# Altium project FP.PrjPcb
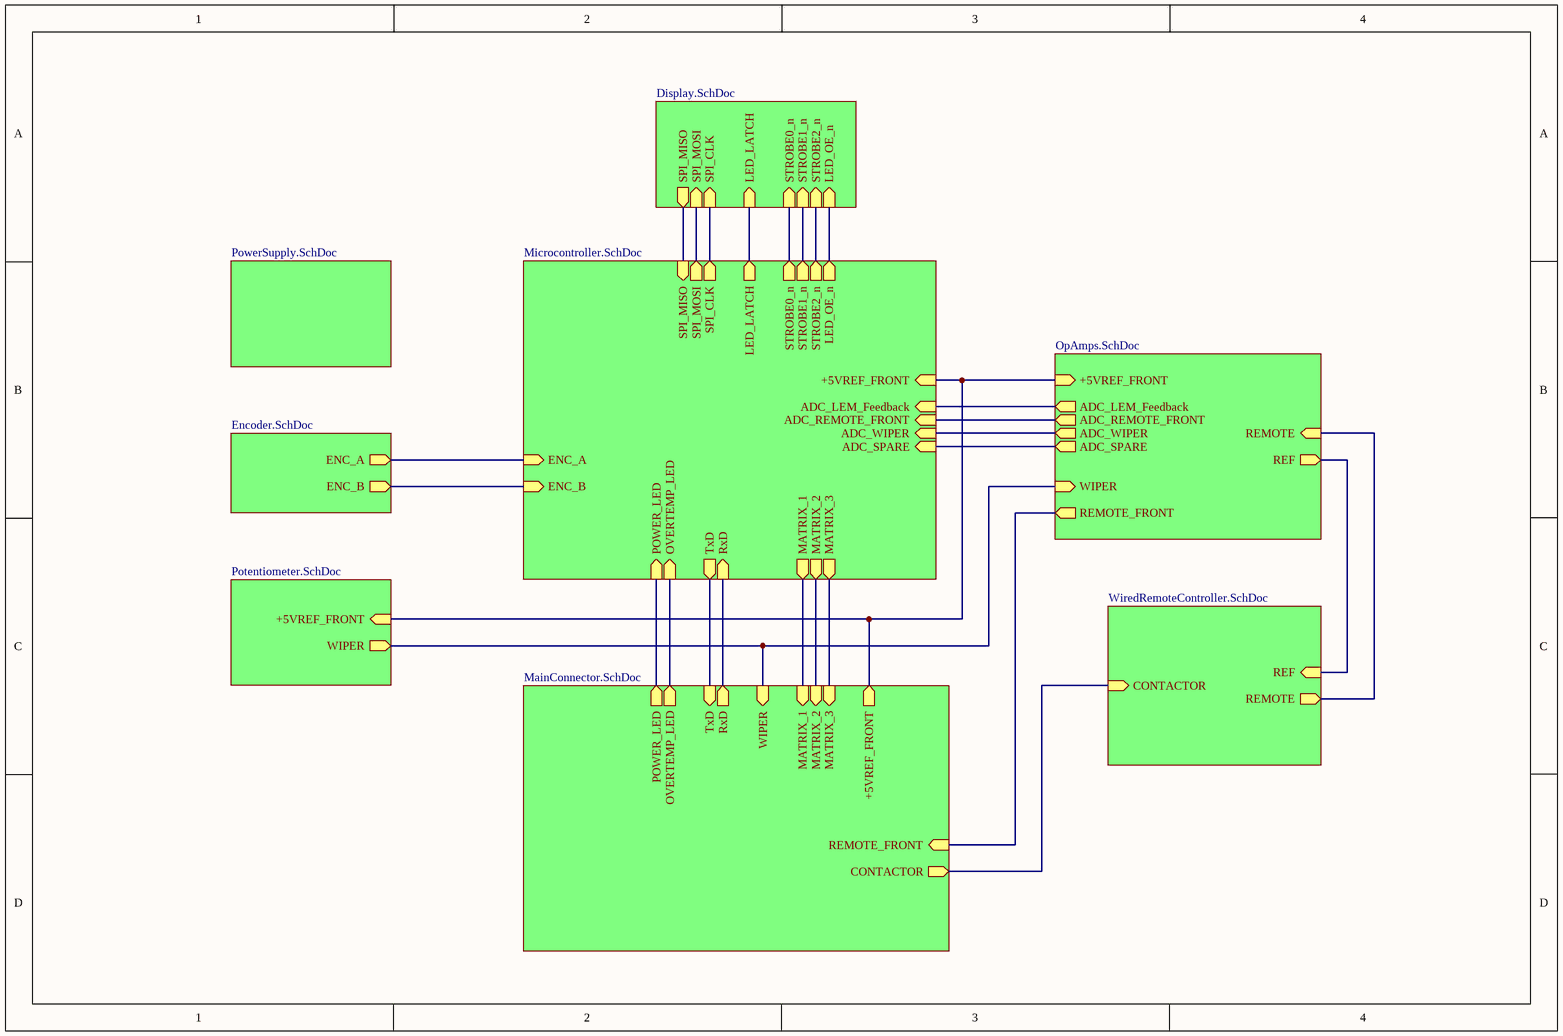
[diagram p0: Main.SchDoc]
9 sheets, 193 parts. Net scope: hierarchical (ports join the sheet entries above them; power ports are global).
Board file: PCB1.PcbDoc
Sheets:
  Main.SchDoc
    PS = PowerSupply.SchDoc
    MC = Microcontroller.SchDoc
    OA = OpAmps.SchDoc
    RC = WiredRemoteController.SchDoc
    D = Display.SchDoc
    E = Encoder.SchDoc
    P = Potentiometer.SchDoc
    C = MainConnector.SchDoc

## Sheet Main.SchDoc
size A4

### Sub-sheets
C = MainConnector.SchDoc: CONTACTOR (out), POWER_LED (out), RxD (out), +5VREF_FRONT (out), OVERTEMP_LED (out), REMOTE_FRONT (in), WIPER (in), MATRIX_3 (in), MATRIX_2 (in), MATRIX_1 (in), TxD (in)
D = Display.SchDoc: SPI_MOSI (in), LED_LATCH (in), STROBE0_n (in), SPI_MISO (out), SPI_CLK (in), STROBE1_n (in), LED_OE_n (in), STROBE2_n (in)
E = Encoder.SchDoc: ENC_B (out), ENC_A (out)
MC = Microcontroller.SchDoc: ADC_REMOTE_FRONT (in), MATRIX_1 (out), MATRIX_3 (out), ADC_LEM_Feedback (in), MATRIX_2 (out), ADC_SPARE (in), ADC_WIPER (in), +5VREF_FRONT (in), ENC_B (in), LED_OE_n (out), LED_LATCH (out), ENC_A (in), STROBE0_n (out), SPI_CLK (out), SPI_MOSI (out), STROBE2_n (out), STROBE1_n (out), SPI_MISO (in), POWER_LED (in), OVERTEMP_LED (in), RxD (in), TxD (out)
OA = OpAmps.SchDoc: REMOTE (in), ADC_WIPER (out), REMOTE_FRONT (out), ADC_REMOTE_FRONT (out), WIPER (in), ADC_SPARE (out), ADC_LEM_Feedback (out), +5VREF_FRONT (in), REF (out)
P = Potentiometer.SchDoc: WIPER (out), +5VREF_FRONT (in)
PS = PowerSupply.SchDoc: no entries
RC = WiredRemoteController.SchDoc: REF (in), REMOTE (out), CONTACTOR (in)

### Nets
+5VREF_FRONT: sheet MC/+5VREF_FRONT, sheet OA/+5VREF_FRONT, sheet P/+5VREF_FRONT, sheet C/+5VREF_FRONT
ADC_LEM_Feedback: sheet MC/ADC_LEM_Feedback, sheet OA/ADC_LEM_Feedback
ADC_REMOTE_FRONT: sheet MC/ADC_REMOTE_FRONT, sheet OA/ADC_REMOTE_FRONT
ADC_SPARE: sheet MC/ADC_SPARE, sheet OA/ADC_SPARE
ADC_WIPER: sheet MC/ADC_WIPER, sheet OA/ADC_WIPER
ENC_A: sheet MC/ENC_A, sheet E/ENC_A
ENC_B: sheet MC/ENC_B, sheet E/ENC_B
LED_LATCH: sheet MC/LED_LATCH, sheet D/LED_LATCH
LED_OE_n: sheet MC/LED_OE_n, sheet D/LED_OE_n
REMOTE_FRONT: sheet OA/REMOTE_FRONT, sheet C/REMOTE_FRONT
STROBE0_n: sheet MC/STROBE0_n, sheet D/STROBE0_n
STROBE1_n: sheet MC/STROBE1_n, sheet D/STROBE1_n
STROBE2_n: sheet MC/STROBE2_n, sheet D/STROBE2_n
NetC1_2: sheet OA/REMOTE, sheet RC/REMOTE
NetC2_2: sheet OA/REF, sheet RC/REF
NetC3_1: sheet MC/OVERTEMP_LED, sheet C/OVERTEMP_LED
NetC4_1: sheet MC/POWER_LED, sheet C/POWER_LED
NetC7_2: sheet RC/CONTACTOR, sheet C/CONTACTOR
NetC22_2: sheet OA/WIPER, sheet P/WIPER, sheet C/WIPER
NetR12_1: sheet MC/SPI_CLK, sheet D/SPI_CLK
NetR15_1: sheet MC/SPI_MOSI, sheet D/SPI_MOSI
NetR18_1: sheet MC/SPI_MISO, sheet D/SPI_MISO
NetR26_2: sheet MC/MATRIX_2, sheet C/MATRIX_2
NetR33_2: sheet MC/MATRIX_3, sheet C/MATRIX_3
NetR38_2: sheet MC/MATRIX_1, sheet C/MATRIX_1
NetR62_2: sheet MC/TxD, sheet C/TxD
NetR63_2: sheet MC/RxD, sheet C/RxD

## Sheet PowerSupply.SchDoc
size A4
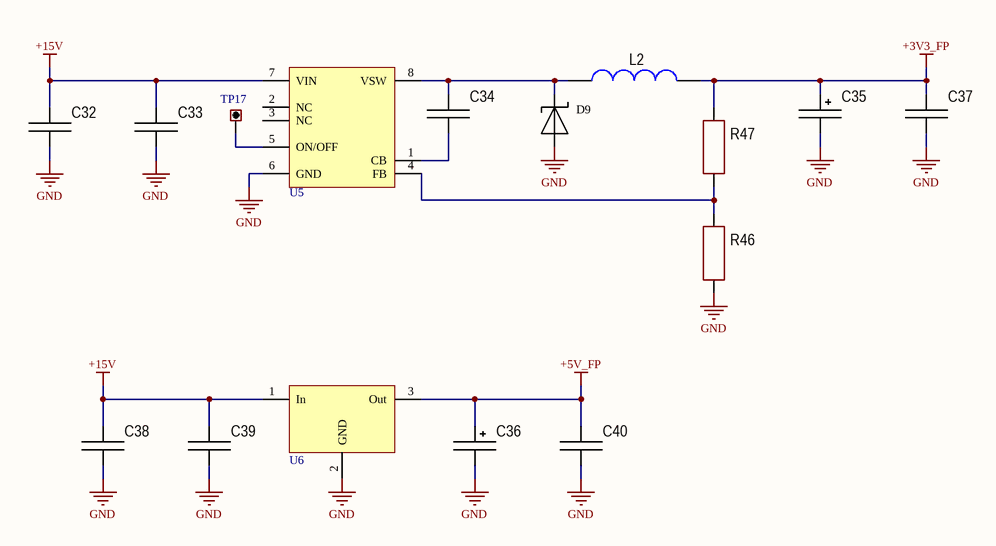
[diagram p1: PowerSupply.SchDoc]

### Parts
C32  (no value)  [CAP: 1210]
C33  (no value)  [CAP: 1206]
C34  (no value)  [CAP: 1206]
C35  (no value)  [CAPAE7866X58L]
C36  (no value)  [CAPAE7866X58L]
C37  (no value)  [CAP: 1206]
C38  (no value)  [CAP: 1210]
C39  (no value)  [CAP: 1206]
C40  (no value)  [CAP: 1206]
D9  (no value)  [DIODE: SMB]
L2  (no value)  [7447720181@WURTH]
R46  (no value)  [RES: 1206]
R47  (no value)  [RES: 1206]
TP17  Test_Point  [Test_Point]  (value not drawn)  (no BOM)
U5  (no value)  [8-SOIC]
U6  (no value)  [DPAK]

### Nets
+3V3_FP: C35.1 C37.2 L2.1 R47.2
+5V_FP: C36.1 C40.2 U6.3(Out)
+15V: C32.2 C33.2 C38.2 C39.2 U5.7(VIN) U6.1(In)
GND: C32.1 C33.1 C35.2 C36.2 C37.1 C38.1 C39.1 C40.1 D9.1 R46.1 U5.6(GND) U6.2(GND)
NetC34_1: C34.1 U5.1(CB)
NetC34_2: C34.2 D9.2 L2.2 U5.8(VSW)
NetR46_2: R46.2 R47.1 U5.4(FB)
NetTP17_1: TP17.1 U5.5(ON/OFF)

Not connected (* = marked no-connect by the designer): U5 2(NC) 3(NC)

### Library data of the parts
C32 = Ceramic_1206: Manufacturer: Yageo; PartNumber: CC1206KRX7R9BB104; ValueManufacturerPartNumber: Ceramic capacitor, 22μF, 1206; TypeCapacitor: Ceramic capacitor; Tolerance: ±10%; TypeDielectric: X7R; Voltage: 35V; Value: 22μF; Package: 1206; HelpURL: https://www.digikey.com/product-detail/en/yageo/CC1206KRX7R9BB104/311-1179-1-ND/303089; Temperature: -55...+125°C
C33 C37 C40 = Ceramic_1206: Manufacturer: Yageo; PartNumber: CC1206KRX7R9BB104; ValueManufacturerPartNumber: Ceramic capacitor, 0.1μF, 1206; TypeCapacitor: Ceramic capacitor; Tolerance: ±10%; TypeDielectric: X7R; Voltage: 50V; Value: 0.1μF; Package: 1206; HelpURL: https://www.digikey.com/product-detail/en/yageo/CC1206KRX7R9BB104/311-1179-1-ND/303089; Temperature: -55...+125°C
C34 C39 = Ceramic_1206: Manufacturer: Yageo; PartNumber: CC1206KRX7R9BB104; ValueManufacturerPartNumber: Ceramic capacitor, 10nF, 1206; TypeCapacitor: Ceramic capacitor; Tolerance: ±10%; TypeDielectric: X7R; Voltage: 50V; Value: 10nF; Package: 1206; HelpURL: https://www.digikey.com/product-detail/en/yageo/CC1206KRX7R9BB104/311-1179-1-ND/303089; Temperature: -55...+125°C
C35 C36 = Aluminium: Manufacturer: Wurth; PartNumber: EEEFK1E470P; ValueManufacturerPartNumber: Aluminium capacitor, EEEFK1E470P, 47μF, 25V, D; TypeCapacitor: Aluminium capacitor; Tolerance: ±20%; Impedance: 54mOhm; Voltage: 25V; Value: 47μF; Package: D; HelpURL: https://www.digikey.com/product-detail/en/wurth-electronics-inc/860080475013/732-9029-1-ND/5728972; Temperature: -55...+105°C
C38 = Ceramic_1206: Manufacturer: Yageo; PartNumber: CC1206KRX7R9BB104; ValueManufacturerPartNumber: Ceramic capacitor, 22μF, 1206; TypeCapacitor: Ceramic capacitor; Tolerance: ±10%; TypeDielectric: X7R; Voltage: 50V; Value: 22μF; Package: 1206; HelpURL: https://www.digikey.com/product-detail/en/yageo/CC1206KRX7R9BB104/311-1179-1-ND/303089; Temperature: -55...+125°C
D9 = MBRS260T3G: ValueManufacturerPartNumber: MBRS260T3G, SMB; Package: SMB; PartNumber: MBRS260T3G
L2 = Inductor_0805: Manufacturer: WURTH; PartNumber: 7447720181; ValueManufacturerPartNumber: Fixed inductor, WURTH, 7447720181, 180μH; TypeInductor: Fixed inductor; MaxCurrent: 1A; Tolerance: ±20%; Value: 180μH; Package: 0805; HelpURL: https://www.digikey.com/product-detail/en/murata-electronics-north-america/LQM21FN100M70L/490-4029-1-ND/1016289; Temperature: -55...+125°C
R46 = Resistor_1206: Manufacturer: Yageo; PartNumber: RC1206JR-07100RL; ValueManufacturerPartNumber: Resistor, 1K, 1206; Power: 0.25W; Tolerance: ±5%; Value: 1K; Package: 1206; HelpURL: https://www.digikey.com/product-detail/en/yageo/RC1206JR-07100RL/311-100ERCT-ND/732153; Temperature: -55...+125°C; TypeResistor: Resistor
R47 = Resistor_1206: Manufacturer: Yageo; PartNumber: RC1206JR-07100RL; ValueManufacturerPartNumber: Resistor, 1.74K, 1206; Power: 0.25W; Tolerance: ±5%; Value: 1.74K; Package: 1206; HelpURL: https://www.digikey.com/product-detail/en/yageo/RC1206JR-07100RL/311-100ERCT-ND/732153; Temperature: -55...+125°C; TypeResistor: Resistor
U5 = LM2675: ValueManufacturerPartNumber: LM2675, SOIC-8; Package: SOIC-8; PartNumber: LM2675
U6 = LM78M05CDT: ValueManufacturerPartNumber: LM78M05CDT, DPAK; Package: DPAK; PartNumber: LM78M05CDT

## Sheet Microcontroller.SchDoc
size A2
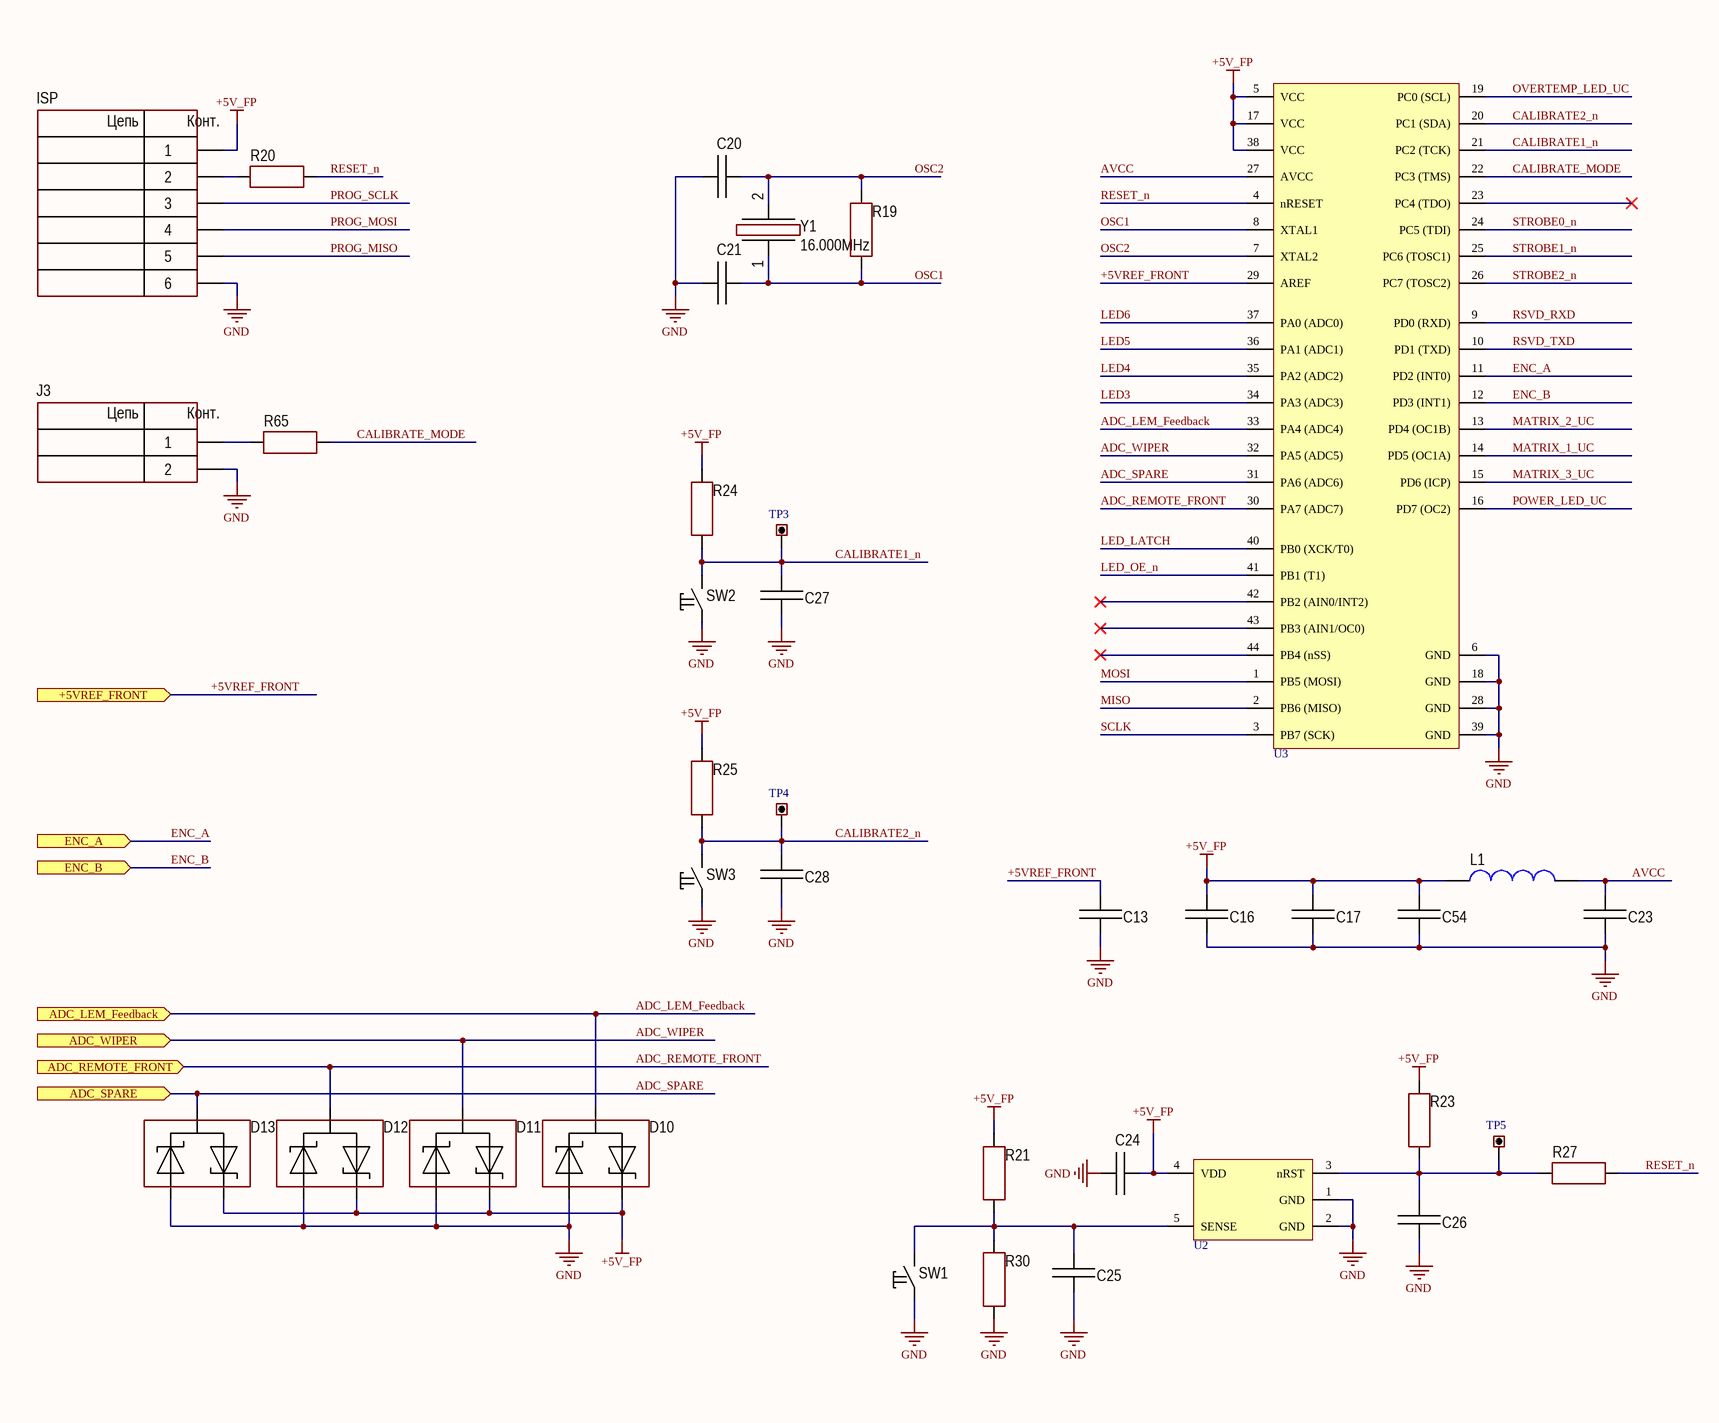
[diagram p2: Microcontroller.SchDoc, left]
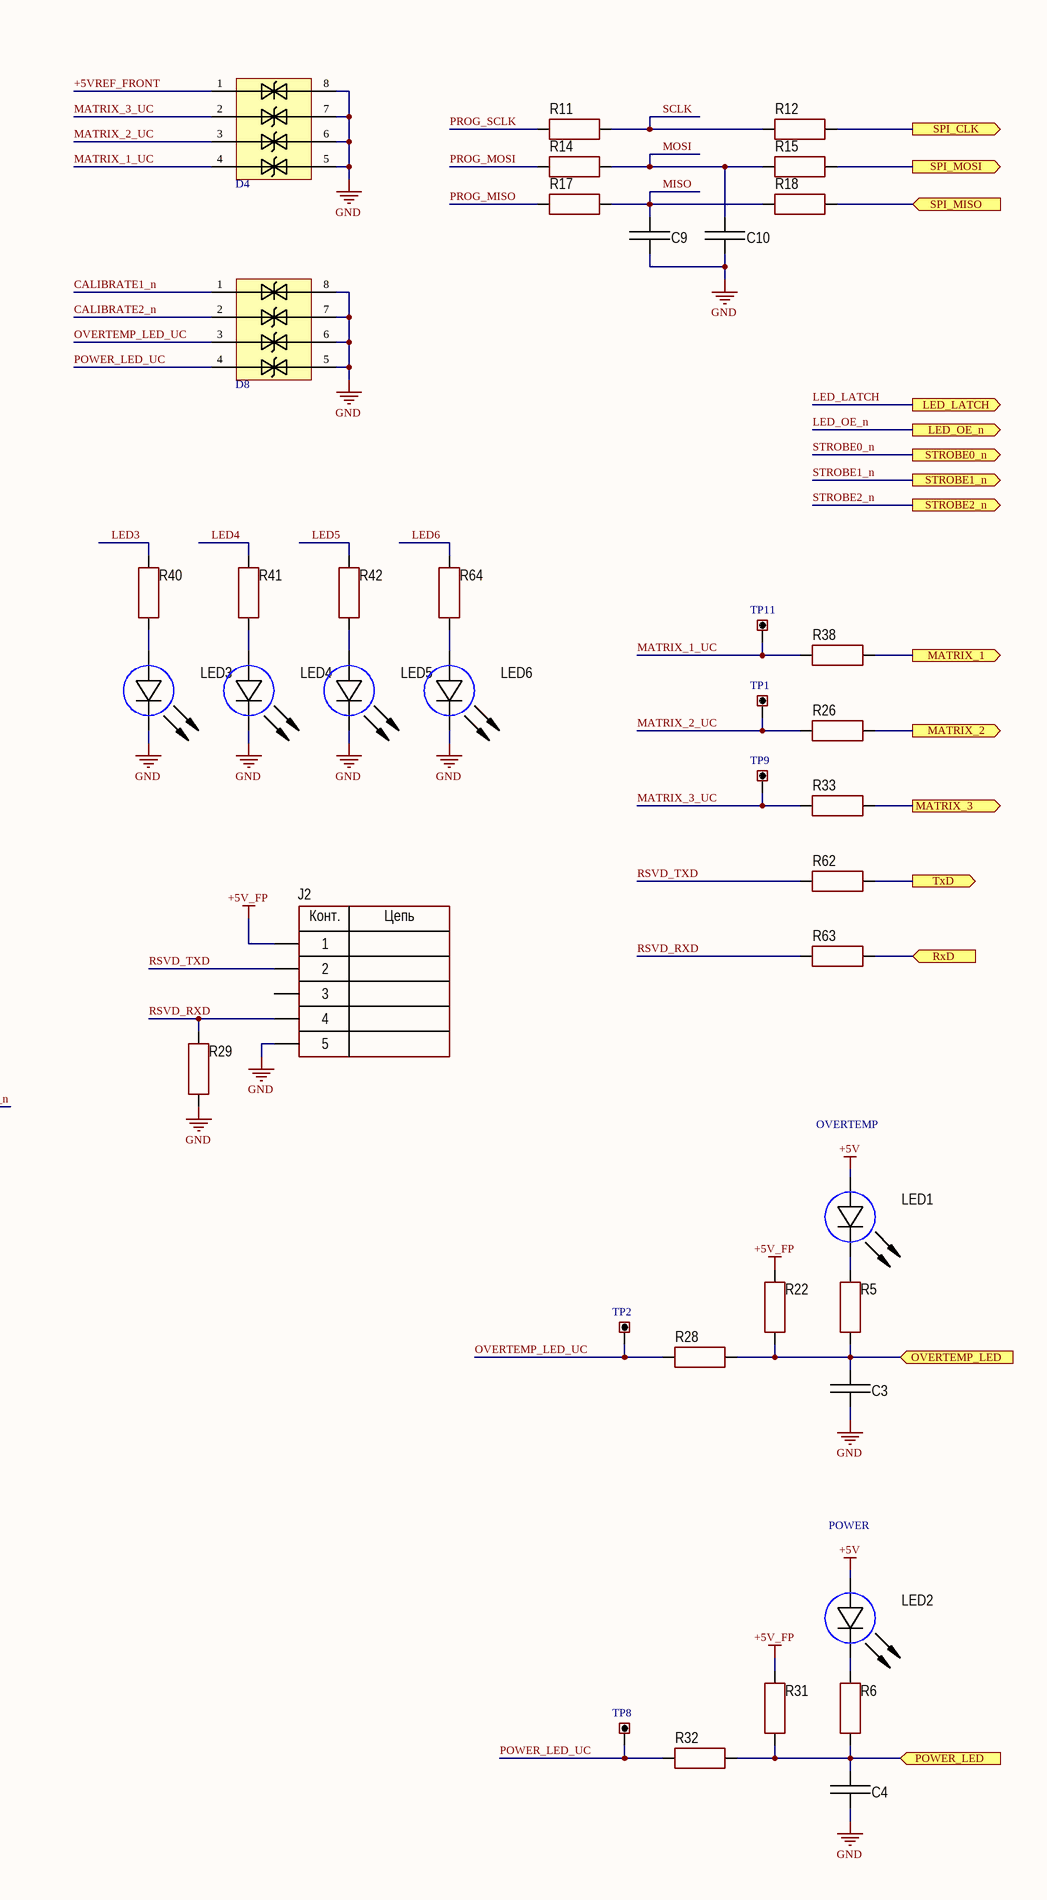
[diagram p3: Microcontroller.SchDoc, right]

### Parts
C3  (no value)  [CAP: 1206]
C4  (no value)  [CAP: 1206]
C9  (no value)  [CAP: 1206]
C10  (no value)  [CAP: 1206]
C13  (no value)  [CAP: 1206]
C16  (no value)  [CAP: 1206]
C17  (no value)  [CAP: 1206]
C20  (no value)  [CAP: 1206]
C21  (no value)  [CAP: 1206]
C23  (no value)  [CAP: 1206]
C24  (no value)  [CAP: 1206]
C25  (no value)  [CAP: 1206]
C26  (no value)  [CAP: 1206]
C27  (no value)  [CAP: 1206]
C28  (no value)  [CAP: 1206]
C54  (no value)  [CAP: 1206]
D4  (no value)  [8-SOIC]
D8  (no value)  [8-SOIC]
D10  (no value)  [SOT23]
D11  (no value)  [SOT23]
D12  (no value)  [SOT23]
D13  (no value)  [SOT23]
ISP  (no value)  [CON: PLS-6]
J2  (no value)  [CON: PLS-5]
J3  (no value)  [CON: PLS-2]
L1  (no value)  [RES: 1206]
LED1  (no value)  [DIODE: LED5MM_Y]
LED2  (no value)  [DIODE: LED5MM_G]
LED3  (no value)  [DIODE: LED5MM_G]
LED4  (no value)  [DIODE: LED5MM_G]
LED5  (no value)  [DIODE: LED5MM_G]
LED6  (no value)  [DIODE: LED5MM_G]
R5  (no value)  [RES: 1206]
R6  (no value)  [RES: 1206]
R11  (no value)  [RES: 1206]
R12  (no value)  [RES: 1206]
R14  (no value)  [RES: 1206]
R15  (no value)  [RES: 1206]
R17  (no value)  [RES: 1206]
R18  (no value)  [RES: 1206]
R19  (no value)  [RES: 1206]
R20  (no value)  [RES: 1206]
R21  (no value)  [RES: 1206]
R22  (no value)  [RES: 1206]
R23  (no value)  [RES: 1206]
R24  (no value)  [RES: 1206]
R25  (no value)  [RES: 1206]
R26  (no value)  [RES: 1206]
R27  (no value)  [RES: 1206]
R28  (no value)  [RES: 1206]
R29  (no value)  [RES: 1206]
R30  (no value)  [RES: 1206]
R31  (no value)  [RES: 1206]
R32  (no value)  [RES: 1206]
R33  (no value)  [RES: 1206]
R38  (no value)  [RES: 1206]
R40  (no value)  [RES: 1206]
R41  (no value)  [RES: 1206]
R42  (no value)  [RES: 1206]
R62  (no value)  [RES: 1206]
R63  (no value)  [RES: 1206]
R64  (no value)  [RES: 1206]
R65  (no value)  [RES: 1206]
SW1  (no value)  [DTSM-32]
SW2  (no value)  [DTSM-32]
SW3  (no value)  [DTSM-32]
TP1  Test_Point  [Test_Point]  (value not drawn)  (no BOM)
TP2  Test_Point  [Test_Point]  (value not drawn)  (no BOM)
TP3  Test_Point  [Test_Point]  (value not drawn)  (no BOM)
TP4  Test_Point  [Test_Point]  (value not drawn)  (no BOM)
TP5  Test_Point  [Test_Point]  (value not drawn)  (no BOM)
TP8  Test_Point  [Test_Point]  (value not drawn)  (no BOM)
TP9  Test_Point  [Test_Point]  (value not drawn)  (no BOM)
TP11  Test_Point  [Test_Point]  (value not drawn)  (no BOM)
U2  (no value)  [TPS3801]
U3  (no value)  [TQFP80P1200X1200X120-44L]
Y1  Frequency: 16.000MHz  [HC49SM]

### Ports
+5VREF_FRONT (in), ADC_LEM_Feedback (in), ADC_REMOTE_FRONT (in), ADC_SPARE (in), ADC_WIPER (in), ENC_A (in), ENC_B (in), LED_LATCH (out), LED_OE_n (out), MATRIX_1 (out), MATRIX_2 (out), MATRIX_3 (out), OVERTEMP_LED (in), POWER_LED (in), RxD (in), SPI_CLK (out), SPI_MISO (in), SPI_MOSI (out), STROBE0_n (out), STROBE1_n (out), STROBE2_n (out), TxD (out)

### Nets
+5V: LED1.1(A) LED2.1(A)
+5V_FP: C16.2 C17.2 C24.2 C54.2 D10.2 D11.2 D12.2 D13.2 ISP.1 J2.1 L1.2 R21.1 R22.2 R23.1 R24.1 R25.1 R31.2 U2.4(VDD) U3.5(VCC) U3.17(VCC) U3.38(VCC)
GND: C3.2 C4.2 C9.1 C10.1 C13.1 C16.1 C17.1 C20.2 C21.2 C23.1 C24.1 C25.1 C26.1 C27.1 C28.1 C54.1 D4.5 D4.6 D4.7 D4.8 D8.5 D8.6 D8.7 D8.8 D10.1 D11.1 D12.1 D13.1 ISP.6 J2.5 J3.2 LED3.2(C) LED4.2(C) LED5.2(C) LED6.2(C) R29.2 R30.2 SW1.1 SW2.1 SW3.1 U2.1(GND) U2.2(GND) U3.6(GND) U3.18(GND) U3.28(GND) U3.39(GND)
+5VREF_FRONT: C13.2 D4.1 U3.29(AREF) ; port +5VREF_FRONT
ADC_LEM_Feedback: D10.3 U3.33(PA4_(ADC4)) ; port ADC_LEM_Feedback
ADC_REMOTE_FRONT: D12.3 U3.30(PA7_(ADC7)) ; port ADC_REMOTE_FRONT
ADC_SPARE: D13.3 U3.31(PA6_(ADC6)) ; port ADC_SPARE
ADC_WIPER: D11.3 U3.32(PA5_(ADC5)) ; port ADC_WIPER
AVCC: C23.2 L1.1 U3.27(AVCC)
CALIBRATE1_n: C27.2 D8.1 R24.2 SW2.2 TP3.1 U3.21(PC2_(TCK))
CALIBRATE2_n: C28.2 D8.2 R25.2 SW3.2 TP4.1 U3.20(PC1_(SDA))
CALIBRATE_MODE: R65.1 U3.22(PC3_(TMS))
ENC_A: U3.11(PD2_(INT0)) ; port ENC_A
ENC_B: U3.12(PD3_(INT1)) ; port ENC_B
LED3: R40.2 U3.34(PA3_(ADC3))
LED4: R41.2 U3.35(PA2_(ADC2))
LED5: R42.2 U3.36(PA1_(ADC1))
LED6: R64.2 U3.37(PA0_(ADC0))
LED_LATCH: U3.40(PB0_(XCK/T0)) ; port LED_LATCH
LED_OE_n: U3.41(PB1_(T1)) ; port LED_OE_n
MATRIX_1_UC: D4.4 R38.1 TP11.1 U3.14(PD5_(OC1A))
MATRIX_2_UC: D4.3 R26.1 TP1.1 U3.13(PD4_(OC1B))
MATRIX_3_UC: D4.2 R33.1 TP9.1 U3.15(PD6_(ICP))
MISO: C9.2 R17.1 R18.2 U3.2(PB6_(MISO))
MOSI: C10.2 R14.1 R15.2 U3.1(PB5_(MOSI))
OSC1: C21.1 R19.2 U3.8(XTAL1) Y1.1
OSC2: C20.1 R19.1 U3.7(XTAL2) Y1.2
OVERTEMP_LED_UC: D8.3 R28.2 TP2.1 U3.19(PC0_(SCL))
POWER_LED_UC: D8.4 R32.1 TP8.1 U3.16(PD7_(OC2))
PROG_MISO: ISP.5 R17.2
PROG_MOSI: ISP.4 R14.2
PROG_SCLK: ISP.3 R11.2
RESET_n: R20.1 R27.1 U3.4(nRESET)
RSVD_RXD: J2.4 R29.1 R63.1 U3.9(PD0_(RXD))
RSVD_TXD: J2.2 R62.1 U3.10(PD1_(TXD))
SCLK: R11.1 R12.2 U3.3(PB7_(SCK))
STROBE0_n: U3.24(PC5_(TDI)) ; port STROBE0_n
STROBE1_n: U3.25(PC6_(TOSC1)) ; port STROBE1_n
STROBE2_n: U3.26(PC7_(TOSC2)) ; port STROBE2_n
NetC3_1: C3.1 R5.1 R22.1 R28.1 ; port OVERTEMP_LED
NetC4_1: C4.1 R6.1 R31.1 R32.2 ; port POWER_LED
NetC25_2: C25.2 R21.2 R30.1 SW1.2 U2.5(SENSE)
NetC26_2: C26.2 R23.2 R27.2 TP5.1 U2.3(nRST)
NetISP_2: ISP.2 R20.2
NetJ3_1: J3.1 R65.2
NetLED1_2: LED1.2(C) R5.2
NetLED2_2: LED2.2(C) R6.2
NetLED3_1: LED3.1(A) R40.1
NetLED4_1: LED4.1(A) R41.1
NetLED5_1: LED5.1(A) R42.1
NetLED6_1: LED6.1(A) R64.1
NetR12_1: R12.1 ; port SPI_CLK
NetR15_1: R15.1 ; port SPI_MOSI
NetR18_1: R18.1 ; port SPI_MISO
NetR26_2: R26.2 ; port MATRIX_2
NetR33_2: R33.2 ; port MATRIX_3
NetR38_2: R38.2 ; port MATRIX_1
NetR62_2: R62.2 ; port TxD
NetR63_2: R63.2 ; port RxD

Not connected (* = marked no-connect by the designer): J2 3; U3 23(PC4_(TDO))* 42(PB2_(AIN0/INT2))* 43(PB3_(AIN1/OC0))* 44(PB4_(nSS))*

### Notes on the sheet
- OVERTEMP
- POWER
- (in symbol PBS-5) Конт.; Цепь
- (in symbol PLS-2) Цепь; Конт.
- (in symbol PLS-6) Цепь; Конт.

### Library data of the parts
C3 C4 C13 C16 C17 C26-C28 C54 = Ceramic_1206: as C33 on sheet PowerSupply; Package: 1206; HelpURL: https://www.digikey.com/product-detail/en/yageo/CC1206KRX7R9BB104/311-1179-1-ND/303089; Temperature: -55...+125°C
C9 C10 C24 C25 = Ceramic_1206: as C34 on sheet PowerSupply; Package: 1206; HelpURL: https://www.digikey.com/product-detail/en/yageo/CC1206KRX7R9BB104/311-1179-1-ND/303089; Temperature: -55...+125°C
C20 C21 = Ceramic_1206: Manufacturer: Yageo; PartNumber: CC1206KRX7R9BB104; ValueManufacturerPartNumber: Ceramic capacitor, 22pF, 1206; TypeCapacitor: Ceramic capacitor; Tolerance: ±10%; TypeDielectric: X7R; Voltage: 50V; Value: 22pF; Package: 1206; HelpURL: https://www.digikey.com/product-detail/en/yageo/CC1206KRX7R9BB104/311-1179-1-ND/303089; Temperature: -55...+125°C
C23 = Ceramic_1206: Manufacturer: Yageo; PartNumber: CC1206KRX7R9BB104; ValueManufacturerPartNumber: Ceramic capacitor, 1.0μF, 1206; TypeCapacitor: Ceramic capacitor; Tolerance: ±10%; TypeDielectric: X7R; Voltage: 50V; Value: 1.0μF; Package: 1206; HelpURL: https://www.digikey.com/product-detail/en/yageo/CC1206KRX7R9BB104/311-1179-1-ND/303089; Temperature: -55...+125°C
D4 D8 = CDNBS08-T05C: ValueManufacturerPartNumber: CDNBS08-T05C, SOIC-8; Package: SOIC-8; PartNumber: CDNBS08-T05C
D10-D13 = Schottky_array: Manufacturer: Diodes Incorporated; ValueManufacturerPartNumber: BAS40-04, SOT23-3; PartNumber: BAS40-04; TypeDiode: Schottky array; Voltage: 40V; Current: 120mA; VoltageDrop: 1V; RecoveryTime: 15pF; Package: SOT23-3; HelpURL: https://www.digikey.com/product-detail/en/diodes-incorporated/MBR0580S1-7/MBR0580S1-7DICT-ND/5080371; Temperature: -55...+150°C
ISP = PLS-6: Manufacturer: Connfly; ValueManufacturerPartNumber: Connector, PLS-6, 6 pin; TypeConnector: Connector; VoltageMax: 500VAC; Pitch: 2.54mm; CurrentMax: 3A; Multichannel: 6 pin; CommentText: "Разъем"; HelpURL: https://www.chipdip.ru/product/pls-6; PartNumber: PLS-6
J2 = PBS-5: Manufacturer: Connfly; ValueManufacturerPartNumber: Connector, PBS-5, 5 pin; TypeConnector: Connector; VoltageMax: 500VAC; Pitch: 2.54mm; CurrentMax: 3A; Multichannel: 5 pin; CommentText: "Разъем"; HelpURL: https://www.chipdip.ru/product/pbs-5; PartNumber: PBS-5
J3 = PLS-2: Manufacturer: Connfly; ValueManufacturerPartNumber: PLS-2, 2pin; TypeConnector: Connector; VoltageMax: 500VAC; Pitch: 2.54mm; CurrentMax: 3A; Multichannel: 2pin; CommentText: "Разъем"; HelpURL: https://www.chipdip.ru/product/pls-2; PartNumber: PLS-2
L1 = Inductor_0805: Manufacturer: Murata Electronics; PartNumber: LQM21FN100M70L; ValueManufacturerPartNumber: Fixed inductor, 100μH, 1206; TypeInductor: Fixed inductor; MaxCurrent: 100mA; Tolerance: ±20%; Value: 100μH; Package: 1206; HelpURL: https://www.digikey.com/product-detail/en/murata-electronics-north-america/LQM21FN100M70L/490-4029-1-ND/1016289; Temperature: -55...+125°C
LED1 = LED_single: ValueManufacturerPartNumber: LED, YELLOW, 5 mm; TypeDiode: LED; ColorParameter: YELLOW; Manufacturer: *; Package: 5 mm; HelpURL: *; Temperature: -55...+150°C; Current: *; VoltageDrop: *; PartNumber: *; Color: YELLOW
LED2 = LED_single: ValueManufacturerPartNumber: LED, BLUE, 5 mm; TypeDiode: LED; ColorParameter: BLUE; Manufacturer: *; Package: 5 mm; HelpURL: *; Temperature: -55...+150°C; Current: *; VoltageDrop: *; PartNumber: *; Color: BLUE
LED3-LED6 = LED_single: ValueManufacturerPartNumber: LED, GREEN, 5 mm; TypeDiode: LED; ColorParameter: GREEN; Manufacturer: *; Package: 5 mm; HelpURL: *; Temperature: -55...+150°C; Current: *; VoltageDrop: *; PartNumber: *; Color: GREEN
R5 R6 R40-R42 R64 = Resistor_1206: Manufacturer: Yageo; PartNumber: RC1206JR-07100RL; ValueManufacturerPartNumber: Resistor, 2K, 1206; Power: 0.25W; Tolerance: ±5%; Value: 2K; Package: 1206; HelpURL: https://www.digikey.com/product-detail/en/yageo/RC1206JR-07100RL/311-100ERCT-ND/732153; Temperature: -55...+125°C; TypeResistor: Resistor
R11 R12 R14 R15 R17 R18 R20 R27 = Resistor_1206: Manufacturer: Yageo; PartNumber: RC1206JR-07100RL; ValueManufacturerPartNumber: Resistor, 47R, 1206; Power: 0.25W; Tolerance: ±5%; Value: 47R; Package: 1206; HelpURL: https://www.digikey.com/product-detail/en/yageo/RC1206JR-07100RL/311-100ERCT-ND/732153; Temperature: -55...+125°C; TypeResistor: Resistor
R19 = Resistor_1206: Manufacturer: Yageo; PartNumber: RC1206JR-07100RL; ValueManufacturerPartNumber: Resistor, 1M, 1206; Power: 0.25W; Tolerance: ±5%; Value: 1M; Package: 1206; HelpURL: https://www.digikey.com/product-detail/en/yageo/RC1206JR-07100RL/311-100ERCT-ND/732153; Temperature: -55...+125°C; TypeResistor: Resistor
R21-R25 R29 R31 = Resistor_1206: Manufacturer: Yageo; PartNumber: RC1206JR-07100RL; ValueManufacturerPartNumber: Resistor, 10K, 1206; Power: 0.25W; Tolerance: ±5%; Value: 10K; Package: 1206; HelpURL: https://www.digikey.com/product-detail/en/yageo/RC1206JR-07100RL/311-100ERCT-ND/732153; Temperature: -55...+125°C; TypeResistor: Resistor
R26 R28 R32 R33 R38 R62 R63 R65 = Resistor_1206: as R46 on sheet PowerSupply; Package: 1206; HelpURL: https://www.digikey.com/product-detail/en/yageo/RC1206JR-07100RL/311-100ERCT-ND/732153; Temperature: -55...+125°C; TypeResistor: Resistor
R30 = Resistor_1206: Manufacturer: Yageo; PartNumber: RC1206JR-07100RL; ValueManufacturerPartNumber: Resistor, 4.32K, 1206; Power: 0.25W; Tolerance: ±5%; Value: 4.32K; Package: 1206; HelpURL: https://www.digikey.com/product-detail/en/yageo/RC1206JR-07100RL/311-100ERCT-ND/732153; Temperature: -55...+125°C; TypeResistor: Resistor
SW1-SW3 = Button_tactile: Manufacturer: TE Connectivity; ValueManufacturerPartNumber: Tactile button, DTSM-32; TypeButton: Tactile button; CommentText: "Кнопка"; HelpURL: https://www.digikey.com/product-detail/en/te-connectivity-alcoswitch-switches/FSM2JSMAATR/450-1792-1-ND/3503931; PartNumber: DTSM-32; Package: 6x6mm
U2 = TPS3801: ValueManufacturerPartNumber: TPS3801, SOT23-5; Package: SOT23-5; PartNumber: TPS3801
U3 = ATMega16-16AU: ValueManufacturerPartNumber: ATMega16-16AU, TQFP-44; Package: TQFP-44; PartNumber: ATMega16-16AU
Y1 = Crystal_3215: Manufacturer: Epson; PartNumber: HC49SM-16.000MHZ-20PF; ValueManufacturerPartNumber: HC49SM-16.000MHZ-20PF, HC49SM; LoadCapacitance: 12.5pF; Tolerance: ±20ppm; Package: HC49SM; HelpURL: https://www.digikey.com/product-detail/en/epson/FC-135-32.7680KA-A5/SER4103CT-ND/6188447; Temperature: -40...+85°C; TypeOscilator: Crystal

## Sheet OpAmps.SchDoc
size A3
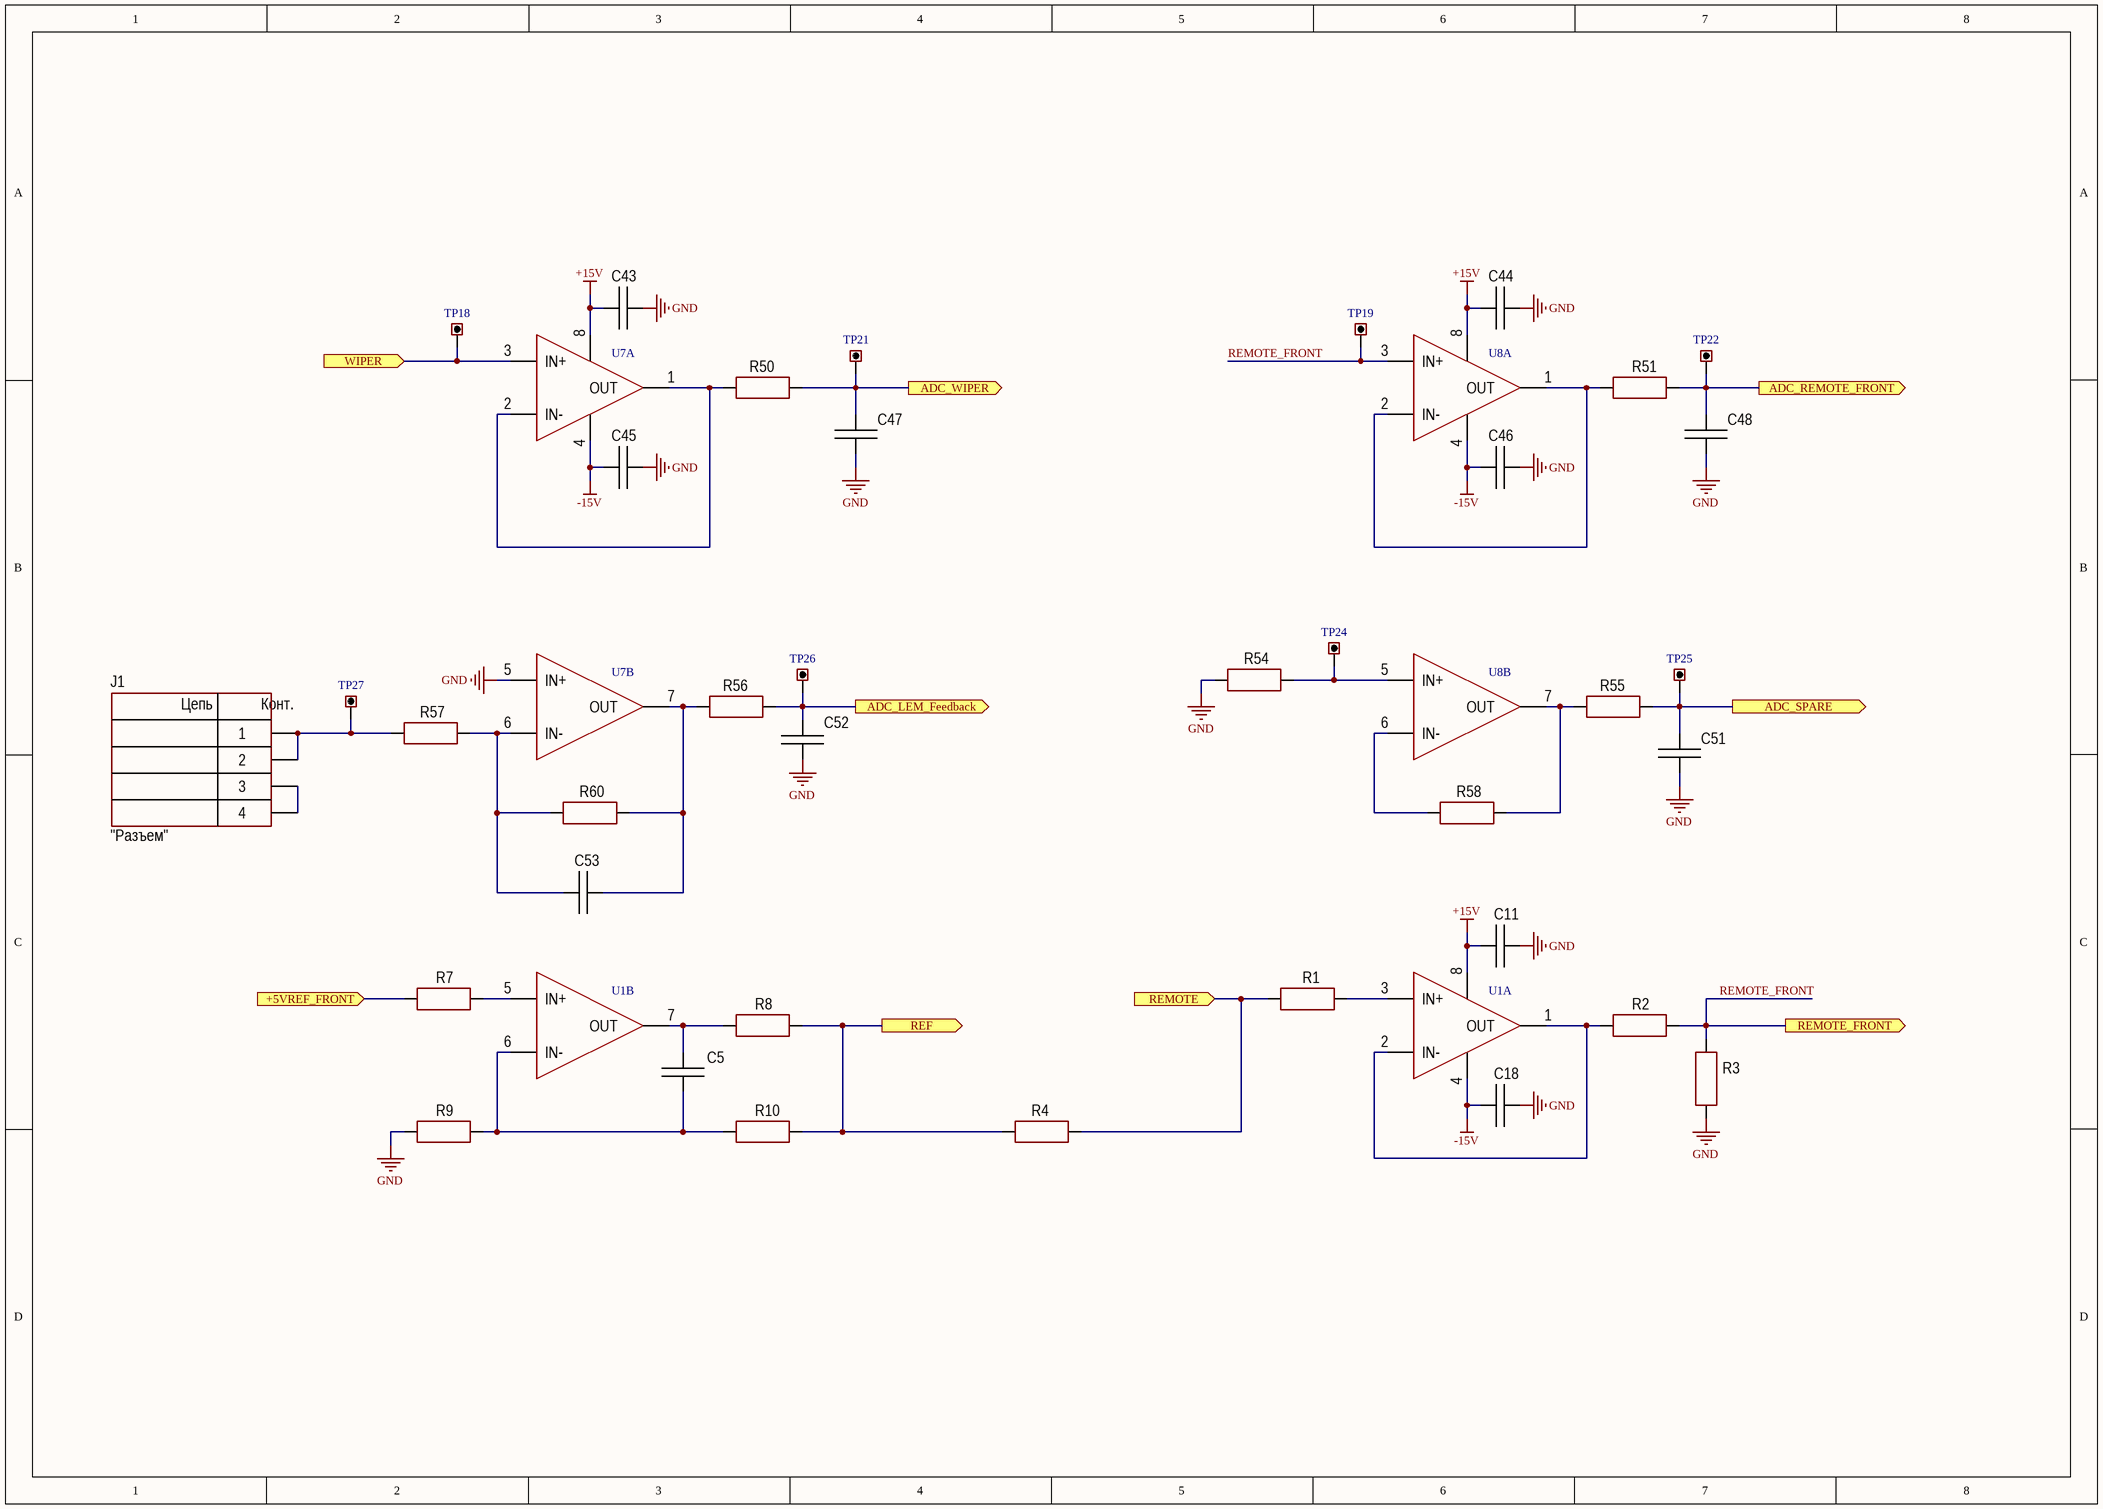
[diagram p4: OpAmps.SchDoc]

### Parts
C5  (no value)  [CAP: 1206]
C11  (no value)  [CAP: 1206]
C18  (no value)  [CAP: 1206]
C43  (no value)  [CAP: 1206]
C44  (no value)  [CAP: 1206]
C45  (no value)  [CAP: 1206]
C46  (no value)  [CAP: 1206]
C47  (no value)  [CAP: 1206]
C48  (no value)  [CAP: 1206]
C51  (no value)  [CAP: 1206]
C52  (no value)  [CAP: 1206]
C53  (no value)  [CAP: 1206]
J1  CommentText: "Разъем"  [39-29-9043]
R1  (no value)  [RES: 1206]
R2  (no value)  [RES: 1206]
R3  (no value)  [RES: 1206]
R4  (no value)  [RES: 1206]
R7  (no value)  [RES: 1206]
R8  (no value)  [RES: 1206]
R9  (no value)  [RES: 1206]
R10  (no value)  [RES: 1206]
R50  (no value)  [RES: 1206]
R51  (no value)  [RES: 1206]
R54  (no value)  [RES: 1206]
R55  (no value)  [RES: 1206]
R56  (no value)  [RES: 1206]
R57  (no value)  [RES: 1206]
R58  (no value)  [RES: 1206]
R60  (no value)  [RES: 1206]
TP18  Test_Point  [Test_Point]  (value not drawn)  (no BOM)
TP19  Test_Point  [Test_Point]  (value not drawn)  (no BOM)
TP21  Test_Point  [Test_Point]  (value not drawn)  (no BOM)
TP22  Test_Point  [Test_Point]  (value not drawn)  (no BOM)
TP24  Test_Point  [Test_Point]  (value not drawn)  (no BOM)
TP25  Test_Point  [Test_Point]  (value not drawn)  (no BOM)
TP26  Test_Point  [Test_Point]  (value not drawn)  (no BOM)
TP27  Test_Point  [Test_Point]  (value not drawn)  (no BOM)
U1  (no value)  [8-SOIC]  (parts A,B of 2)
U7  (no value)  [8-SOIC]  (parts A,B of 2)
U8  (no value)  [8-SOIC]  (parts A,B of 2)

### Ports
+5VREF_FRONT (in), ADC_LEM_Feedback (out), ADC_REMOTE_FRONT (out), ADC_SPARE (out), ADC_WIPER (out), REF (out), REMOTE (in), REMOTE_FRONT (out), WIPER (in)

### Nets
+15V: C11.2 C43.2 C44.2 U1.8(V+) U7.8(V+) U8.8(V+)
-15V: C18.1 C45.2 C46.2 U1.4(V-) U7.4(V-) U8.4(V-)
GND: C11.1 C18.2 C43.1 C44.1 C45.1 C46.1 C47.1 C48.1 C51.1 C52.1 R3.1 R9.1 R54.1 U7.5(IN+)
+5VREF_FRONT: R7.1 ; port +5VREF_FRONT
ADC_LEM_Feedback: C52.2 R56.2 TP26.1 ; port ADC_LEM_Feedback
ADC_REMOTE_FRONT: C48.2 R51.2 TP22.1 ; port ADC_REMOTE_FRONT
ADC_SPARE: C51.2 R55.2 TP25.1 ; port ADC_SPARE
ADC_WIPER: C47.2 R50.2 TP21.1 ; port ADC_WIPER
REMOTE_FRONT: R2.2 R3.2 TP19.1 U8.3(IN+) ; port REMOTE_FRONT
NetC1_2: R1.1 R4.2 ; port REMOTE
NetC2_2: R4.1 R8.2 R10.2 ; port REF
NetC5_1: C5.1 R9.2 R10.1 U1.6(IN-)
NetC5_2: C5.2 R8.1 U1.7(OUT)
NetC22_2: TP18.1 U7.3(IN+) ; port WIPER
NetC53_1: C53.1 R56.1 R60.2 U7.7(OUT)
NetC53_2: C53.2 R57.2 R60.1 U7.6(IN-)
NetJ1_1: J1.1 J1.2 R57.1 TP27.1
NetJ1_3: J1.3 J1.4
NetR1_2: R1.2 U1.3(IN+)
NetR2_1: R2.1 U1.1(OUT) U1.2(IN-)
NetR7_2: R7.2 U1.5(IN+)
NetR50_1: R50.1 U7.1(OUT) U7.2(IN-)
NetR51_1: R51.1 U8.1(OUT) U8.2(IN-)
NetR54_2: R54.2 TP24.1 U8.5(IN+)
NetR55_1: R55.1 R58.2 U8.7(OUT)
NetR58_1: R58.1 U8.6(IN-)

### Notes on the sheet
- (in symbol PBD-4) Цепь; Конт.

### Library data of the parts
C5 C11 C18 C43-C46 C53 = Ceramic_1206: as C33 on sheet PowerSupply; Package: 1206; HelpURL: https://www.digikey.com/product-detail/en/yageo/CC1206KRX7R9BB104/311-1179-1-ND/303089; Temperature: -55...+125°C
C47 C48 C51 C52 = Ceramic_1206: Manufacturer: Yageo; PartNumber: CC1206KRX7R9BB104; ValueManufacturerPartNumber: Ceramic capacitor, 33pF, 1206; TypeCapacitor: Ceramic capacitor; Tolerance: ±10%; TypeDielectric: X7R; Voltage: 50V; Value: 33pF; Package: 1206; HelpURL: https://www.digikey.com/product-detail/en/yageo/CC1206KRX7R9BB104/311-1179-1-ND/303089; Temperature: -55...+125°C
J1 = PBD-4: Manufacturer: MOLEX; ValueManufacturerPartNumber: Connector, MOLEX, 39-29-9043, 4pin; TypeConnector: Connector; VoltageMax: 500VAC; Pitch: 2.54mm; CurrentMax: 3A; Multichannel: 4pin; HelpURL: https://www.chipdip.ru/product/pbd-4; PartNumber: 39-29-9043
R1 R7 R9 R10 R54 R58 R60 = Resistor_1206: as R21 on sheet Microcontroller; Package: 1206; HelpURL: https://www.digikey.com/product-detail/en/yageo/RC1206JR-07100RL/311-100ERCT-ND/732153; Temperature: -55...+125°C; TypeResistor: Resistor
R2 R3 = Resistor_1206: as R5 on sheet Microcontroller; Package: 1206; HelpURL: https://www.digikey.com/product-detail/en/yageo/RC1206JR-07100RL/311-100ERCT-ND/732153; Temperature: -55...+125°C; TypeResistor: Resistor
R4 = Resistor_1206: Manufacturer: Yageo; PartNumber: RC1206JR-07100RL; ValueManufacturerPartNumber: Resistor, 100K, 1206; Power: 0.25W; Tolerance: ±5%; Value: 100K; Package: 1206; HelpURL: https://www.digikey.com/product-detail/en/yageo/RC1206JR-07100RL/311-100ERCT-ND/732153; Temperature: -55...+125°C; TypeResistor: Resistor
R8 = Resistor_1206: Manufacturer: Yageo; PartNumber: RC1206JR-07100RL; ValueManufacturerPartNumber: Resistor, 10R, 1206; Power: 0.25W; Tolerance: ±5%; Value: 10R; Package: 1206; HelpURL: https://www.digikey.com/product-detail/en/yageo/RC1206JR-07100RL/311-100ERCT-ND/732153; Temperature: -55...+125°C; TypeResistor: Resistor
R50 R51 R55 R56 = Resistor_1206: as R46 on sheet PowerSupply; Package: 1206; HelpURL: https://www.digikey.com/product-detail/en/yageo/RC1206JR-07100RL/311-100ERCT-ND/732153; Temperature: -55...+125°C; TypeResistor: Resistor
R57 = Resistor_1206: Manufacturer: Yageo; PartNumber: RC1206JR-07100RL; ValueManufacturerPartNumber: Resistor, 20K, 1206; Power: 0.25W; Tolerance: ±5%; Value: 20K; Package: 1206; HelpURL: https://www.digikey.com/product-detail/en/yageo/RC1206JR-07100RL/311-100ERCT-ND/732153; Temperature: -55...+125°C; TypeResistor: Resistor
U1 U7 U8 = TL082: ValueManufacturerPartNumber: TL082, SOIC-8; Package: SOIC-8; PartNumber: TL082

## Sheet WiredRemoteController.SchDoc
size A4
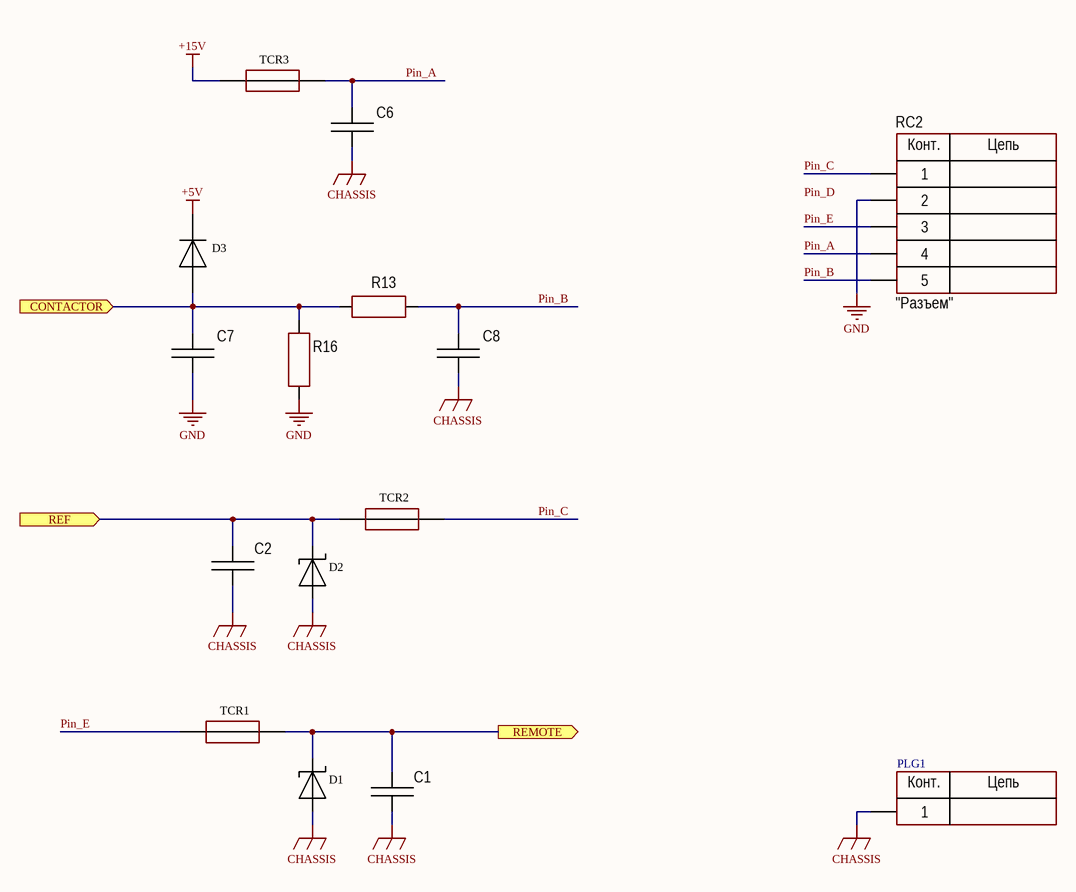
[diagram p5: WiredRemoteController.SchDoc]

### Parts
C1  (no value)  [CAPC4564X22M]
C2  (no value)  [CAPC4564X22M]
C6  (no value)  [CAPC4564X22M]
C7  (no value)  [CAP: 1206]
C8  (no value)  [CAPC4564X22M]
D1  (no value)  [DIODE: SMC]
D2  (no value)  [DIODE: SMC]
D3  (no value)  [SOT23]
PLG1  PLG1  [PLG1]  (value not drawn)  (no BOM)
R13  (no value)  [RES: 1206]
R16  (no value)  [RES: 1206]
RC2  CommentText: "Разъем"  [MOLEX 39-30-3056]
TCR1  (no value)  [TRF250-120T-B-0.5]
TCR2  (no value)  [TRF250-120T-B-0.5]
TCR3  (no value)  [TRF250-120T-B-0.5]

### Ports
CONTACTOR (in), REF (in), REMOTE (out)

### Nets
+5V: D3.3
+15V: TCR3.1
CHASSIS: C1.1 C2.1 C6.1 C8.1 D1.1(A) D2.1(A) PLG1.1
GND: C7.1 R16.1 RC2.2
Pin_A: C6.2 RC2.4 TCR3.2
Pin_B: C8.2 R13.1 RC2.5
Pin_C: RC2.1 TCR2.2
Pin_E: RC2.3 TCR1.2
NetC1_2: C1.2 D1.2(C) TCR1.1 ; port REMOTE
NetC2_2: C2.2 D2.2(C) TCR2.1 ; port REF
NetC7_2: C7.2 D3.1 R13.2 R16.2 ; port CONTACTOR

### Notes on the sheet
- Labels drawn without touching a wire or pin: Pin_D
- (in symbol PBS-5) Конт.; Цепь
- (in symbol PLG1) Конт.; Цепь

### Library data of the parts
C1 C2 C6 C8 = Ceramic_1206: Manufacturer: Yageo; PartNumber: CC1206KRX7R9BB104; ValueManufacturerPartNumber: Ceramic capacitor, 0.1μF, 1825; TypeCapacitor: Ceramic capacitor; Tolerance: ±10%; TypeDielectric: X7R; Voltage: 630V; Value: 0.1μF; Package: 1825; HelpURL: https://www.digikey.com/product-detail/en/yageo/CC1206KRX7R9BB104/311-1179-1-ND/303089; Temperature: -55...+125°C
C7 = Ceramic_1206: as C33 on sheet PowerSupply; Package: 1206; HelpURL: https://www.digikey.com/product-detail/en/yageo/CC1206KRX7R9BB104/311-1179-1-ND/303089; Temperature: -55...+125°C
D1 D2 = SMCJ15A: ValueManufacturerPartNumber: SMCJ15A, SMC; Package: SMC; PartNumber: SMCJ15A
D3 = MMBD4148: ValueManufacturerPartNumber: MMBD4148, SOT23; Package: SOT23; PartNumber: MMBD4148
R13 = Resistor_1206: as R21 on sheet Microcontroller; Package: 1206; HelpURL: https://www.digikey.com/product-detail/en/yageo/RC1206JR-07100RL/311-100ERCT-ND/732153; Temperature: -55...+125°C; TypeResistor: Resistor
R16 = Resistor_1206: Manufacturer: Yageo; PartNumber: RC1206JR-07100RL; ValueManufacturerPartNumber: Resistor, 4.99K, 1206; Power: 0.25W; Tolerance: ±5%; Value: 4.99K; Package: 1206; HelpURL: https://www.digikey.com/product-detail/en/yageo/RC1206JR-07100RL/311-100ERCT-ND/732153; Temperature: -55...+125°C; TypeResistor: Resistor
RC2 = PBS-5: Manufacturer: MOLEX; ValueManufacturerPartNumber: Connector, MOLEX, 39-30-3056, 5pin; TypeConnector: Connector; VoltageMax: 500VAC; Pitch: 2.54mm; CurrentMax: 3A; Multichannel: 5pin; HelpURL: https://www.chipdip.ru/product/pbs-5; PartNumber: 39-30-3056
TCR1-TCR3 = TRF250-120T-B-0.5: ValueManufacturerPartNumber: TRF250-120T-B-0.5; PartNumber: TRF250-120T-B-0.5

## Sheet Display.SchDoc
size A3
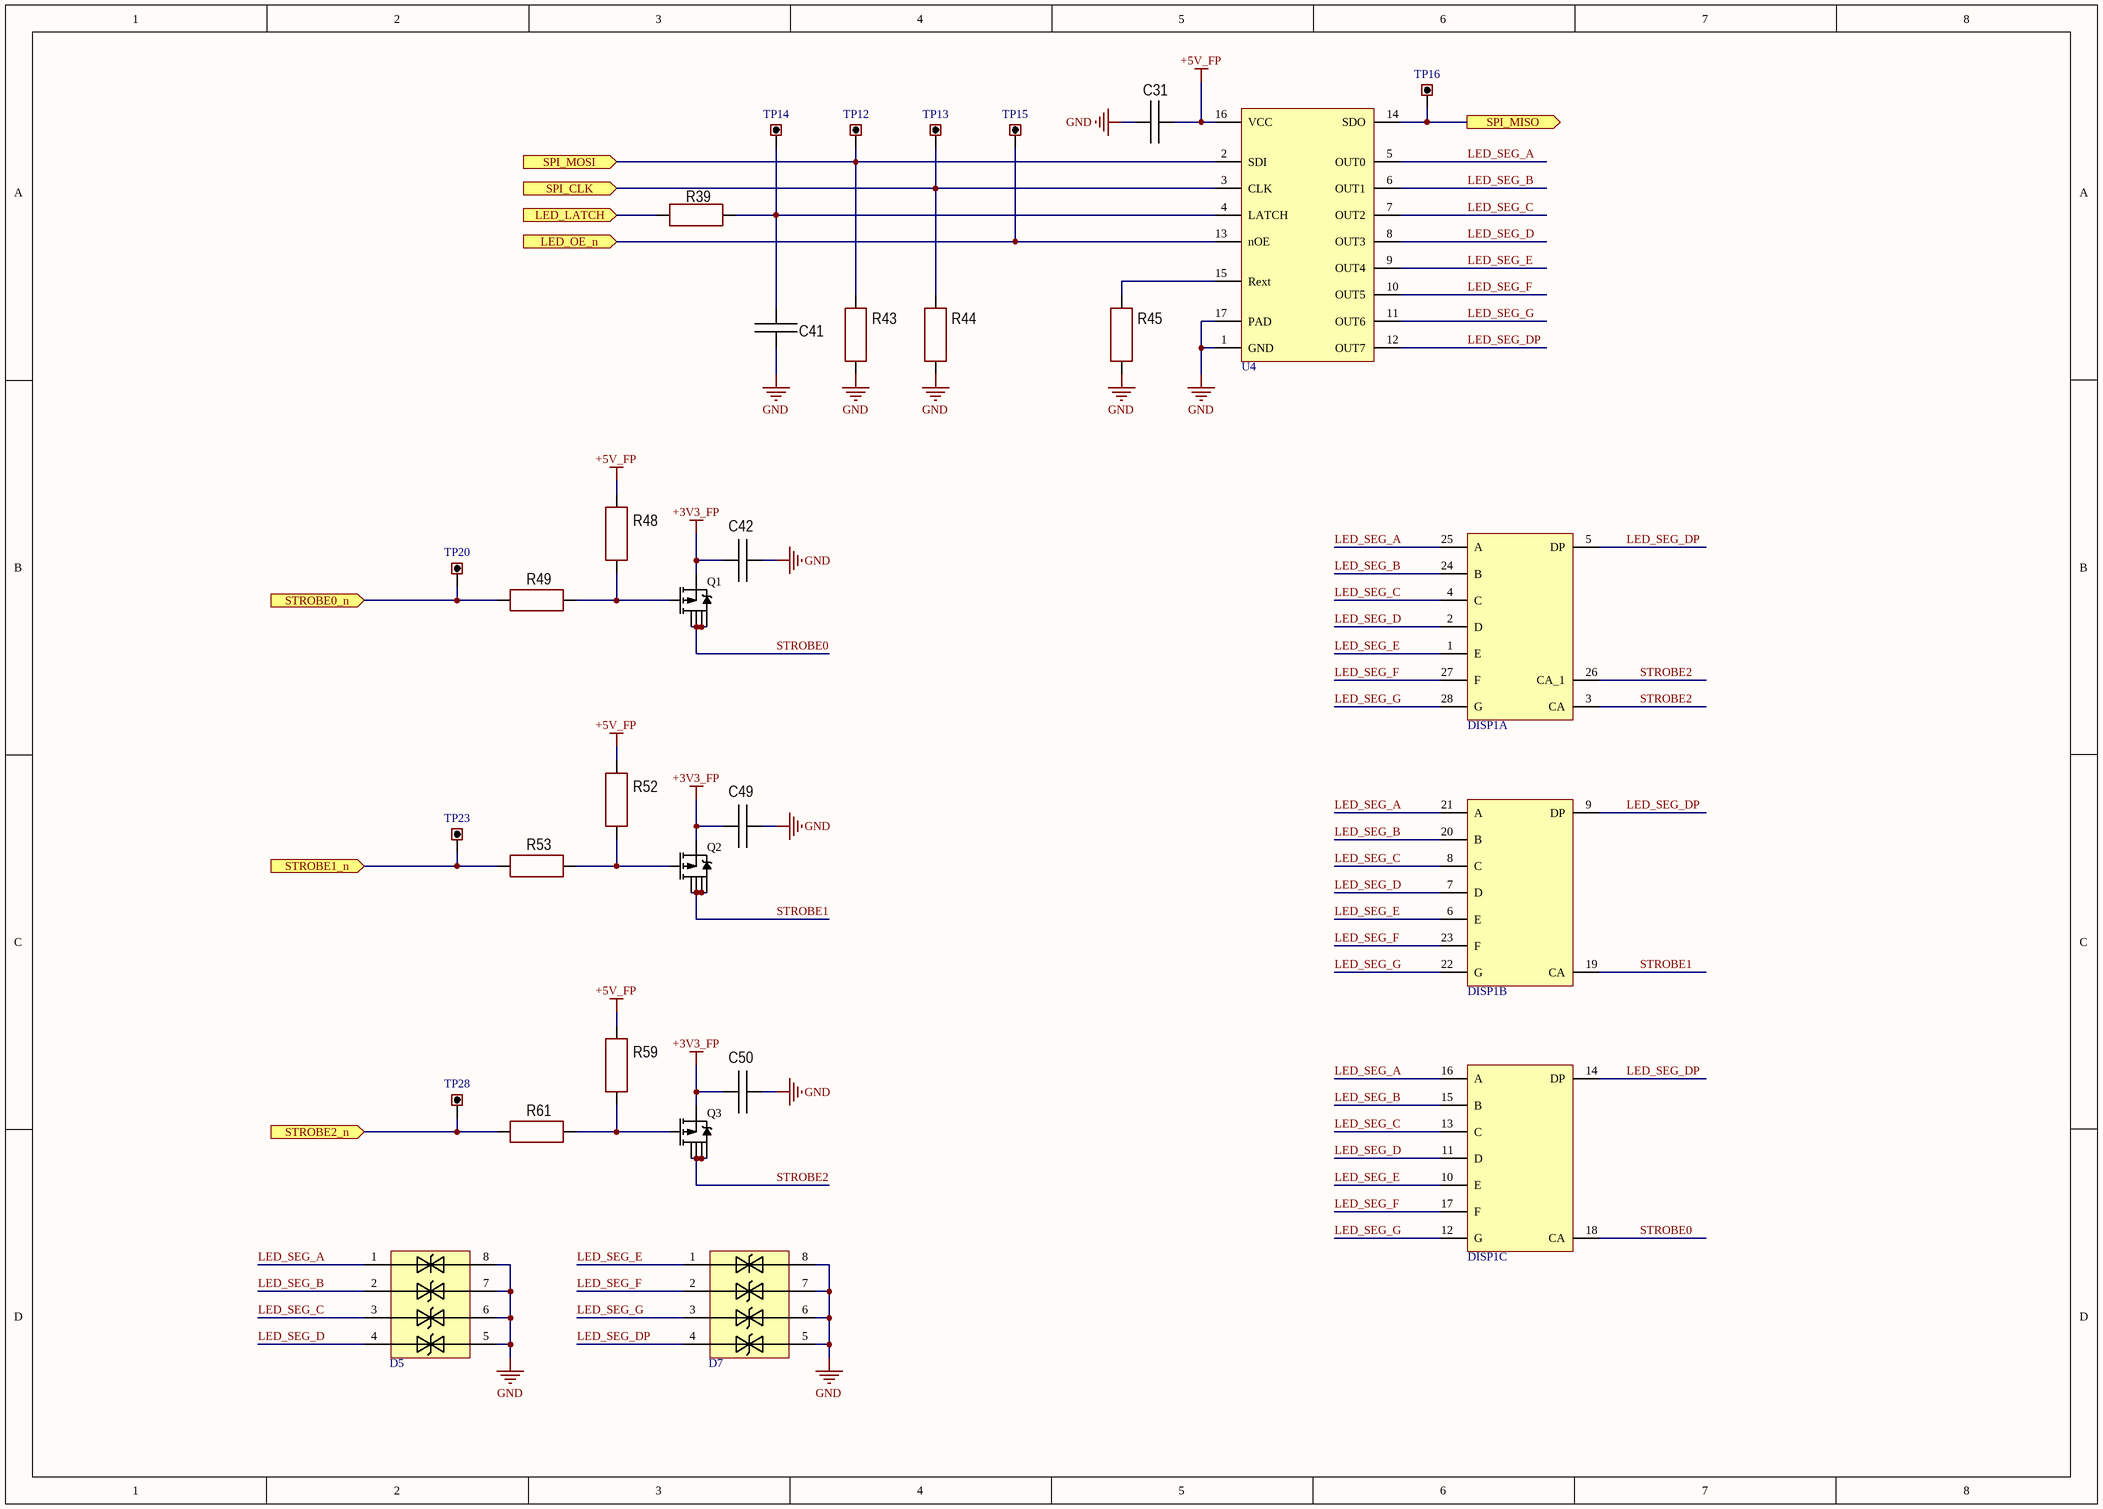
[diagram p6: Display.SchDoc]

### Parts
C31  (no value)  [CAP: 1206]
C41  (no value)  [CAP: 1206]
C42  (no value)  [CAP: 1206]
C49  (no value)  [CAP: 1206]
C50  (no value)  [CAP: 1206]
D5  (no value)  [8-SOIC]
D7  (no value)  [8-SOIC]
DISP1  (no value)  [BC56-11SRWA]  (parts A,B,C of 3)
Q1  (no value)  [SOT23-6]
Q2  (no value)  [SOT23-6]
Q3  (no value)  [SOT23-6]
R39  (no value)  [RES: 1206]
R43  (no value)  [RES: 1206]
R44  (no value)  [RES: 1206]
R45  (no value)  [RES: 1206]
R48  (no value)  [RES: 1206]
R49  (no value)  [RES: 1206]
R52  (no value)  [RES: 1206]
R53  (no value)  [RES: 1206]
R59  (no value)  [RES: 1206]
R61  (no value)  [RES: 1206]
TP12  Test_Point  [Test_Point]  (value not drawn)  (no BOM)
TP13  Test_Point  [Test_Point]  (value not drawn)  (no BOM)
TP14  Test_Point  [Test_Point]  (value not drawn)  (no BOM)
TP15  Test_Point  [Test_Point]  (value not drawn)  (no BOM)
TP16  Test_Point  [Test_Point]  (value not drawn)  (no BOM)
TP20  Test_Point  [Test_Point]  (value not drawn)  (no BOM)
TP23  Test_Point  [Test_Point]  (value not drawn)  (no BOM)
TP28  Test_Point  [Test_Point]  (value not drawn)  (no BOM)
U4  (no value)  [STP08DP05]

### Ports
LED_LATCH (in), LED_OE_n (in), SPI_CLK (in), SPI_MISO (out), SPI_MOSI (in), STROBE0_n (in), STROBE1_n (in), STROBE2_n (in)

### Nets
+3V3_FP: C42.1 C49.1 C50.1 Q1.4(S) Q2.4(S) Q3.4(S)
+5V_FP: C31.2 R48.2 R52.2 R59.2 U4.16(VCC)
GND: C31.1 C41.1 C42.2 C49.2 C50.2 D5.5 D5.6 D5.7 D5.8 D7.5 D7.6 D7.7 D7.8 R43.2 R44.2 R45.2 U4.1(GND) U4.17(PAD)
LED_LATCH: R39.1 ; port LED_LATCH
LED_OE_n: TP15.1 U4.13(nOE) ; port LED_OE_n
LED_SEG_A: D5.1 DISP1.16(A) DISP1.21(A) DISP1.25(A) U4.5(OUT0)
LED_SEG_B: D5.2 DISP1.15(B) DISP1.20(B) DISP1.24(B) U4.6(OUT1)
LED_SEG_C: D5.3 DISP1.4(C) DISP1.8(C) DISP1.13(C) U4.7(OUT2)
LED_SEG_D: D5.4 DISP1.2(D) DISP1.7(D) DISP1.11(D) U4.8(OUT3)
LED_SEG_DP: D7.4 DISP1.5(DP) DISP1.9(DP) DISP1.14(DP) U4.12(OUT7)
LED_SEG_E: D7.1 DISP1.1(E) DISP1.6(E) DISP1.10(E) U4.9(OUT4)
LED_SEG_F: D7.2 DISP1.17(F) DISP1.23(F) DISP1.27(F) U4.10(OUT5)
LED_SEG_G: D7.3 DISP1.12(G) DISP1.22(G) DISP1.28(G) U4.11(OUT6)
STROBE0: DISP1.18(CA) Q1.1(D) Q1.2(D) Q1.5(D) Q1.6(D)
STROBE0_n: R49.1 TP20.1 ; port STROBE0_n
STROBE1: DISP1.19(CA) Q2.1(D) Q2.2(D) Q2.5(D) Q2.6(D)
STROBE1_n: R53.1 TP23.1 ; port STROBE1_n
STROBE2: DISP1.3(CA) DISP1.26(CA_1) Q3.1(D) Q3.2(D) Q3.5(D) Q3.6(D)
STROBE2_n: R61.1 TP28.1 ; port STROBE2_n
NetC41_2: C41.2 R39.2 TP14.1 U4.4(LATCH)
NetQ1_3: Q1.3(G) R48.1 R49.2
NetQ2_3: Q2.3(G) R52.1 R53.2
NetQ3_3: Q3.3(G) R59.1 R61.2
NetR12_1: R44.1 TP13.1 U4.3(CLK) ; port SPI_CLK
NetR15_1: R43.1 TP12.1 U4.2(SDI) ; port SPI_MOSI
NetR18_1: TP16.1 U4.14(SDO) ; port SPI_MISO
NetR45_1: R45.1 U4.15(Rext)

### Library data of the parts
C31 C42 C49 C50 = Ceramic_1206: as C33 on sheet PowerSupply; Package: 1206; HelpURL: https://www.digikey.com/product-detail/en/yageo/CC1206KRX7R9BB104/311-1179-1-ND/303089; Temperature: -55...+125°C
C41 = Ceramic_1206: as C34 on sheet PowerSupply; Package: 1206; HelpURL: https://www.digikey.com/product-detail/en/yageo/CC1206KRX7R9BB104/311-1179-1-ND/303089; Temperature: -55...+125°C
D5 D7 = CDNBS08-T05C: as D4 on sheet Microcontroller; Package: SOIC-8; PartNumber: CDNBS08-T05C
DISP1 = BC56-11SRWA: ValueManufacturerPartNumber: LED display, BA56-11SRWA; PartNumber: BA56-11SRWA
Q1-Q3 = DMP2067LVT: ValueManufacturerPartNumber: DMP2067LVT, SOT23-6; Package: SOT23-6; PartNumber: DMP2067LVT
R39 = Resistor_1206: as R11 on sheet Microcontroller; Package: 1206; HelpURL: https://www.digikey.com/product-detail/en/yageo/RC1206JR-07100RL/311-100ERCT-ND/732153; Temperature: -55...+125°C; TypeResistor: Resistor
R43 R44 = Resistor_1206: as R21 on sheet Microcontroller; Package: 1206; HelpURL: https://www.digikey.com/product-detail/en/yageo/RC1206JR-07100RL/311-100ERCT-ND/732153; Temperature: -55...+125°C; TypeResistor: Resistor
R45 R48 R52 R59 = Resistor_1206: as R46 on sheet PowerSupply; Package: 1206; HelpURL: https://www.digikey.com/product-detail/en/yageo/RC1206JR-07100RL/311-100ERCT-ND/732153; Temperature: -55...+125°C; TypeResistor: Resistor
R49 R53 R61 = Resistor_1206: Manufacturer: Yageo; PartNumber: RC1206JR-07100RL; ValueManufacturerPartNumber: Resistor, 22.1R, 1206; Power: 0.25W; Tolerance: ±5%; Value: 22.1R; Package: 1206; HelpURL: https://www.digikey.com/product-detail/en/yageo/RC1206JR-07100RL/311-100ERCT-ND/732153; Temperature: -55...+125°C; TypeResistor: Resistor
U4 = STP08DP05: ValueManufacturerPartNumber: STP08DP05, TSOP-16; Package: TSOP-16; PartNumber: STP08DP05

## Sheet Encoder.SchDoc
size A4
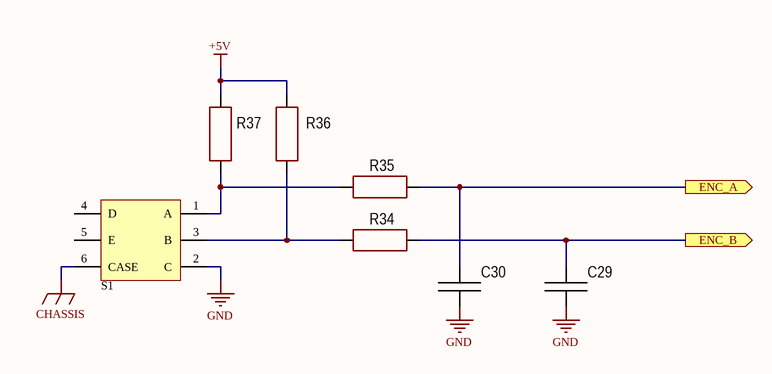
[diagram p7: Encoder.SchDoc]

### Parts
C29  (no value)  [CAP: 1206]
C30  (no value)  [CAP: 1206]
R34  (no value)  [RES: 1206]
R35  (no value)  [RES: 1206]
R36  (no value)  [RES: 1206]
R37  (no value)  [RES: 1206]
S1  (no value)  [PEC11L]

### Ports
ENC_A (out), ENC_B (out)

### Nets
+5V: R36.2 R37.2
CHASSIS: S1.6(CASE)
GND: C29.1 C30.1 S1.2(C)
ENC_A: C30.2 R35.1 ; port ENC_A
ENC_B: C29.2 R34.2 ; port ENC_B
NetR34_1: R34.1 R36.1 S1.3(B)
NetR35_2: R35.2 R37.1 S1.1(A)

Not connected (* = marked no-connect by the designer): S1 4(D) 5(E)

### Library data of the parts
C29 C30 = Ceramic_1206: as C34 on sheet PowerSupply; Package: 1206; HelpURL: https://www.digikey.com/product-detail/en/yageo/CC1206KRX7R9BB104/311-1179-1-ND/303089; Temperature: -55...+125°C
R34 R35 = Resistor_1206: as R21 on sheet Microcontroller; Package: 1206; HelpURL: https://www.digikey.com/product-detail/en/yageo/RC1206JR-07100RL/311-100ERCT-ND/732153; Temperature: -55...+125°C; TypeResistor: Resistor
R36 R37 = Resistor_1206: as R46 on sheet PowerSupply; Package: 1206; HelpURL: https://www.digikey.com/product-detail/en/yageo/RC1206JR-07100RL/311-100ERCT-ND/732153; Temperature: -55...+125°C; TypeResistor: Resistor
S1 = PEC11L: ValueManufacturerPartNumber: PEC11L; PartNumber: PEC11L

## Sheet Potentiometer.SchDoc
size A4
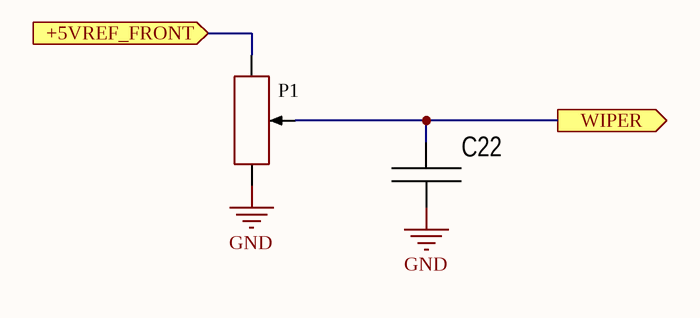
[diagram p8: Potentiometer.SchDoc]

### Parts
C22  (no value)  [CAP: 1206]
P1  (no value)  [СП4-2МА]

### Ports
+5VREF_FRONT (in), WIPER (out)

### Nets
GND: C22.1 P1.1(CCW)
+5VREF_FRONT: P1.3(CW) ; port +5VREF_FRONT
NetC22_2: C22.2 P1.2 ; port WIPER

### Library data of the parts
C22 = Ceramic_1206: as C33 on sheet PowerSupply; Package: 1206; HelpURL: https://www.digikey.com/product-detail/en/yageo/CC1206KRX7R9BB104/311-1179-1-ND/303089; Temperature: -55...+125°C
P1 = СП4-2МА: ValueManufacturerPartNumber: СП4-2МА; PartNumber: СП4-2МА

## Sheet MainConnector.SchDoc
size A4
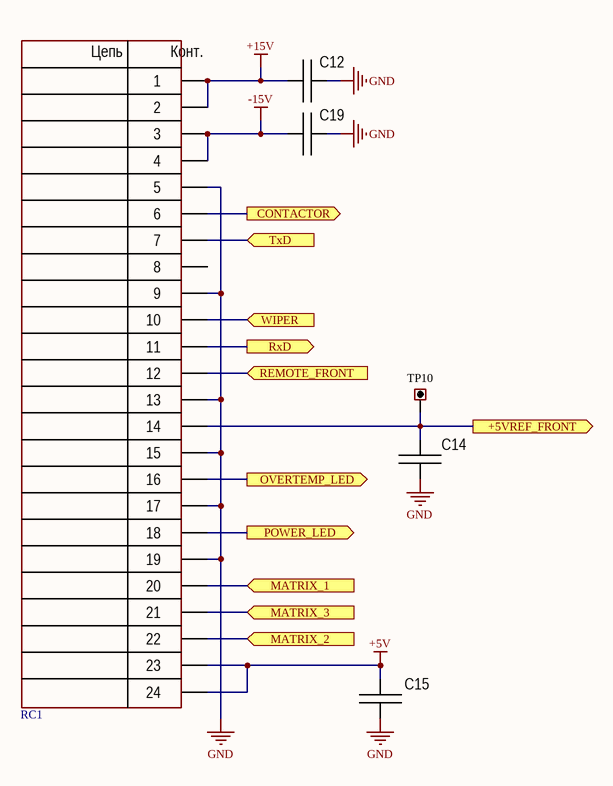
[diagram p9: MainConnector.SchDoc]

### Parts
C12  (no value)  [CAP: 1206]
C14  (no value)  [CAP: 1206]
C15  (no value)  [CAP: 1206]
C19  (no value)  [CAP: 1206]
RC1  (no value)  [DS1018-24 SIBX]
TP10  Test_Point  [Test_Point]  (value not drawn)  (no BOM)

### Ports
+5VREF_FRONT (out), CONTACTOR (out), MATRIX_1 (in), MATRIX_2 (in), MATRIX_3 (in), OVERTEMP_LED (out), POWER_LED (out), REMOTE_FRONT (in), RxD (out), TxD (in), WIPER (in)

### Nets
+5V: C15.2 RC1.23 RC1.24
+15V: C12.2 RC1.1 RC1.2
-15V: C19.1 RC1.3 RC1.4
GND: C12.1 C14.1 C15.1 C19.2 RC1.5 RC1.9 RC1.13 RC1.15 RC1.17 RC1.19
+5VREF_FRONT: C14.2 RC1.14 TP10.1 ; port +5VREF_FRONT
REMOTE_FRONT: RC1.12 ; port REMOTE_FRONT
NetC3_1: RC1.16 ; port OVERTEMP_LED
NetC4_1: RC1.18 ; port POWER_LED
NetC7_2: RC1.6 ; port CONTACTOR
NetC22_2: RC1.10 ; port WIPER
NetR26_2: RC1.22 ; port MATRIX_2
NetR33_2: RC1.21 ; port MATRIX_3
NetR38_2: RC1.20 ; port MATRIX_1
NetR62_2: RC1.7 ; port TxD
NetR63_2: RC1.11 ; port RxD

Not connected (* = marked no-connect by the designer): RC1 8

### Notes on the sheet
- (in symbol DS1018-24 SIBX) Цепь; Конт.

### Library data of the parts
C12 C14 C15 C19 = Ceramic_1206: as C33 on sheet PowerSupply; Package: 1206; HelpURL: https://www.digikey.com/product-detail/en/yageo/CC1206KRX7R9BB104/311-1179-1-ND/303089; Temperature: -55...+125°C
RC1 = DS1018-24 SIBX: ValueManufacturerPartNumber: Connector, DS1018-24 SIBX, 24 pin; Multichannel: 24 pin; TypeConnector: Connector; PartNumber: DS1018-24 SIBX

## Nets that join several sheets
+3V3_FP: PowerSupply (C35.1 C37.2 L2.1 R47.2), Display (6 pins)
+5V: Microcontroller (LED1.1 LED2.1), WiredRemoteController (D3.3), Encoder (R36.2 R37.2), MainConnector (C15.2 RC1.23 RC1.24)
+5V_FP: PowerSupply (C36.1 C40.2 U6.3), Microcontroller (21 pins), Display (5 pins)
+15V: PowerSupply (6 pins), OpAmps (6 pins), WiredRemoteController (TCR3.1), MainConnector (C12.2 RC1.1 RC1.2)
-15V: OpAmps (6 pins), MainConnector (C19.1 RC1.3 RC1.4)
CHASSIS: WiredRemoteController (7 pins), Encoder (S1.6)
GND: PowerSupply (12 pins), Microcontroller (46 pins), OpAmps (14 pins), WiredRemoteController (C7.1 R16.1 RC2.2), Display (18 pins), Encoder (C29.1 C30.1 S1.2), Potentiometer (C22.1 P1.1), MainConnector (10 pins)
+5VREF_FRONT: Microcontroller (C13.2 D4.1 U3.29), OpAmps (R7.1), Potentiometer (P1.3), MainConnector (C14.2 RC1.14 TP10.1)
ADC_LEM_Feedback: Microcontroller (D10.3 U3.33), OpAmps (C52.2 R56.2 TP26.1)
ADC_REMOTE_FRONT: Microcontroller (D12.3 U3.30), OpAmps (C48.2 R51.2 TP22.1)
ADC_SPARE: Microcontroller (D13.3 U3.31), OpAmps (C51.2 R55.2 TP25.1)
ADC_WIPER: Microcontroller (D11.3 U3.32), OpAmps (C47.2 R50.2 TP21.1)
ENC_A: Microcontroller (U3.11), Encoder (C30.2 R35.1)
ENC_B: Microcontroller (U3.12), Encoder (C29.2 R34.2)
LED_LATCH: Microcontroller (U3.40), Display (R39.1)
LED_OE_n: Microcontroller (U3.41), Display (TP15.1 U4.13)
NetC1_2: OpAmps (R1.1 R4.2), WiredRemoteController (C1.2 D1.2 TCR1.1)
NetC2_2: OpAmps (R4.1 R8.2 R10.2), WiredRemoteController (C2.2 D2.2 TCR2.1)
NetC3_1: Microcontroller (C3.1 R5.1 R22.1 R28.1), MainConnector (RC1.16)
NetC4_1: Microcontroller (C4.1 R6.1 R31.1 R32.2), MainConnector (RC1.18)
NetC7_2: WiredRemoteController (C7.2 D3.1 R13.2 R16.2), MainConnector (RC1.6)
NetC22_2: OpAmps (TP18.1 U7.3), Potentiometer (C22.2 P1.2), MainConnector (RC1.10)
NetR12_1: Microcontroller (R12.1), Display (R44.1 TP13.1 U4.3)
NetR15_1: Microcontroller (R15.1), Display (R43.1 TP12.1 U4.2)
NetR18_1: Microcontroller (R18.1), Display (TP16.1 U4.14)
NetR26_2: Microcontroller (R26.2), MainConnector (RC1.22)
NetR33_2: Microcontroller (R33.2), MainConnector (RC1.21)
NetR38_2: Microcontroller (R38.2), MainConnector (RC1.20)
NetR62_2: Microcontroller (R62.2), MainConnector (RC1.7)
NetR63_2: Microcontroller (R63.2), MainConnector (RC1.11)
REMOTE_FRONT: OpAmps (R2.2 R3.2 TP19.1 U8.3), MainConnector (RC1.12)
STROBE0_n: Microcontroller (U3.24), Display (R49.1 TP20.1)
STROBE1_n: Microcontroller (U3.25), Display (R53.1 TP23.1)
STROBE2_n: Microcontroller (U3.26), Display (R61.1 TP28.1)